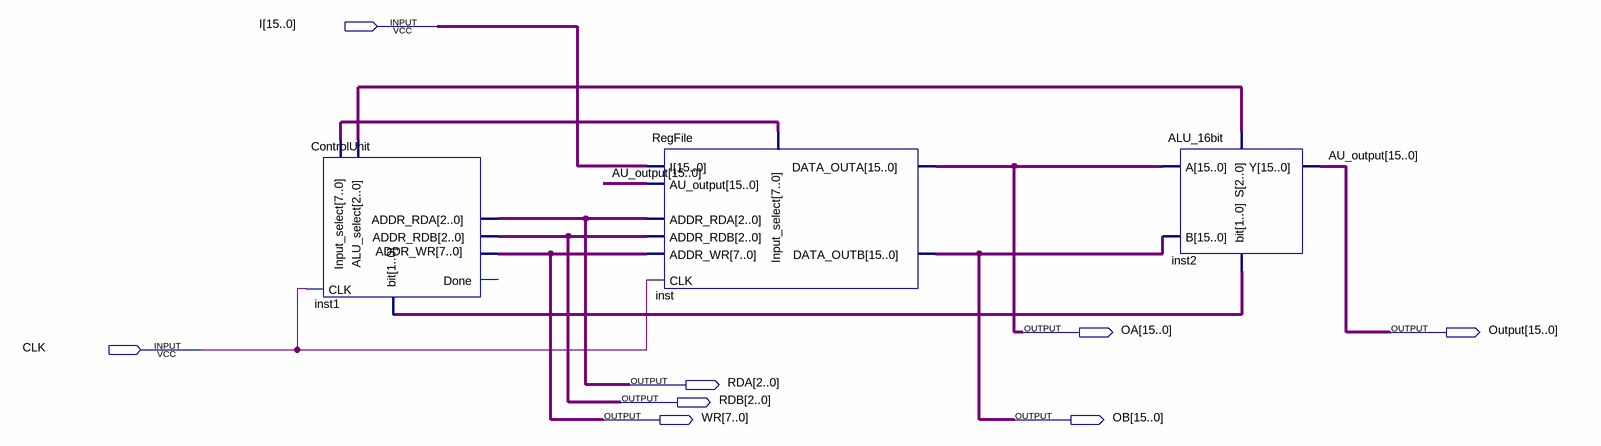
[diagram p0: schematic sheet]
// Quartus schematic main - Copy.bdf as structural Verilog: 3 symbols, 8 pins
module \main_-_Copy  (
  input  [15:0] I,
  input  CLK,
  output [15:0] OA,
  output [15:0] Output,
  output [2:0] RDA,
  output [2:0] RDB,
  output [7:0] WR,
  output [15:0] OB
);

  wire [1:0] inst1_bit;
  wire [2:0] inst1_alu_select;
  wire [7:0] inst1_input_select;

  ControlUnit inst1 (
    .CLK(CLK), .ADDR_WR(WR), .ADDR_RDA(RDA), .ADDR_RDB(RDB), .Input_select(inst1_input_select),
    .ALU_select(inst1_alu_select), .\bit (inst1_bit));  // open: Done
  RegFile inst (
    .I(I), .AU_output(Output), .Input_select(inst1_input_select), .ADDR_RDA(RDA), .ADDR_WR(WR), .CLK(CLK),
    .ADDR_RDB(RDB), .DATA_OUTA(OA), .DATA_OUTB(OB));
  ALU_16bit inst2 (.S(inst1_alu_select), .A(OA), .B(OB), .\bit (inst1_bit), .Y(Output));

  // Other names for the same wires on the sheet: AU_output[15:0] = Output
endmodule
